# EAGLE design SDuino_ultramicroOLED_Dual (EAGLE 7.1.0)
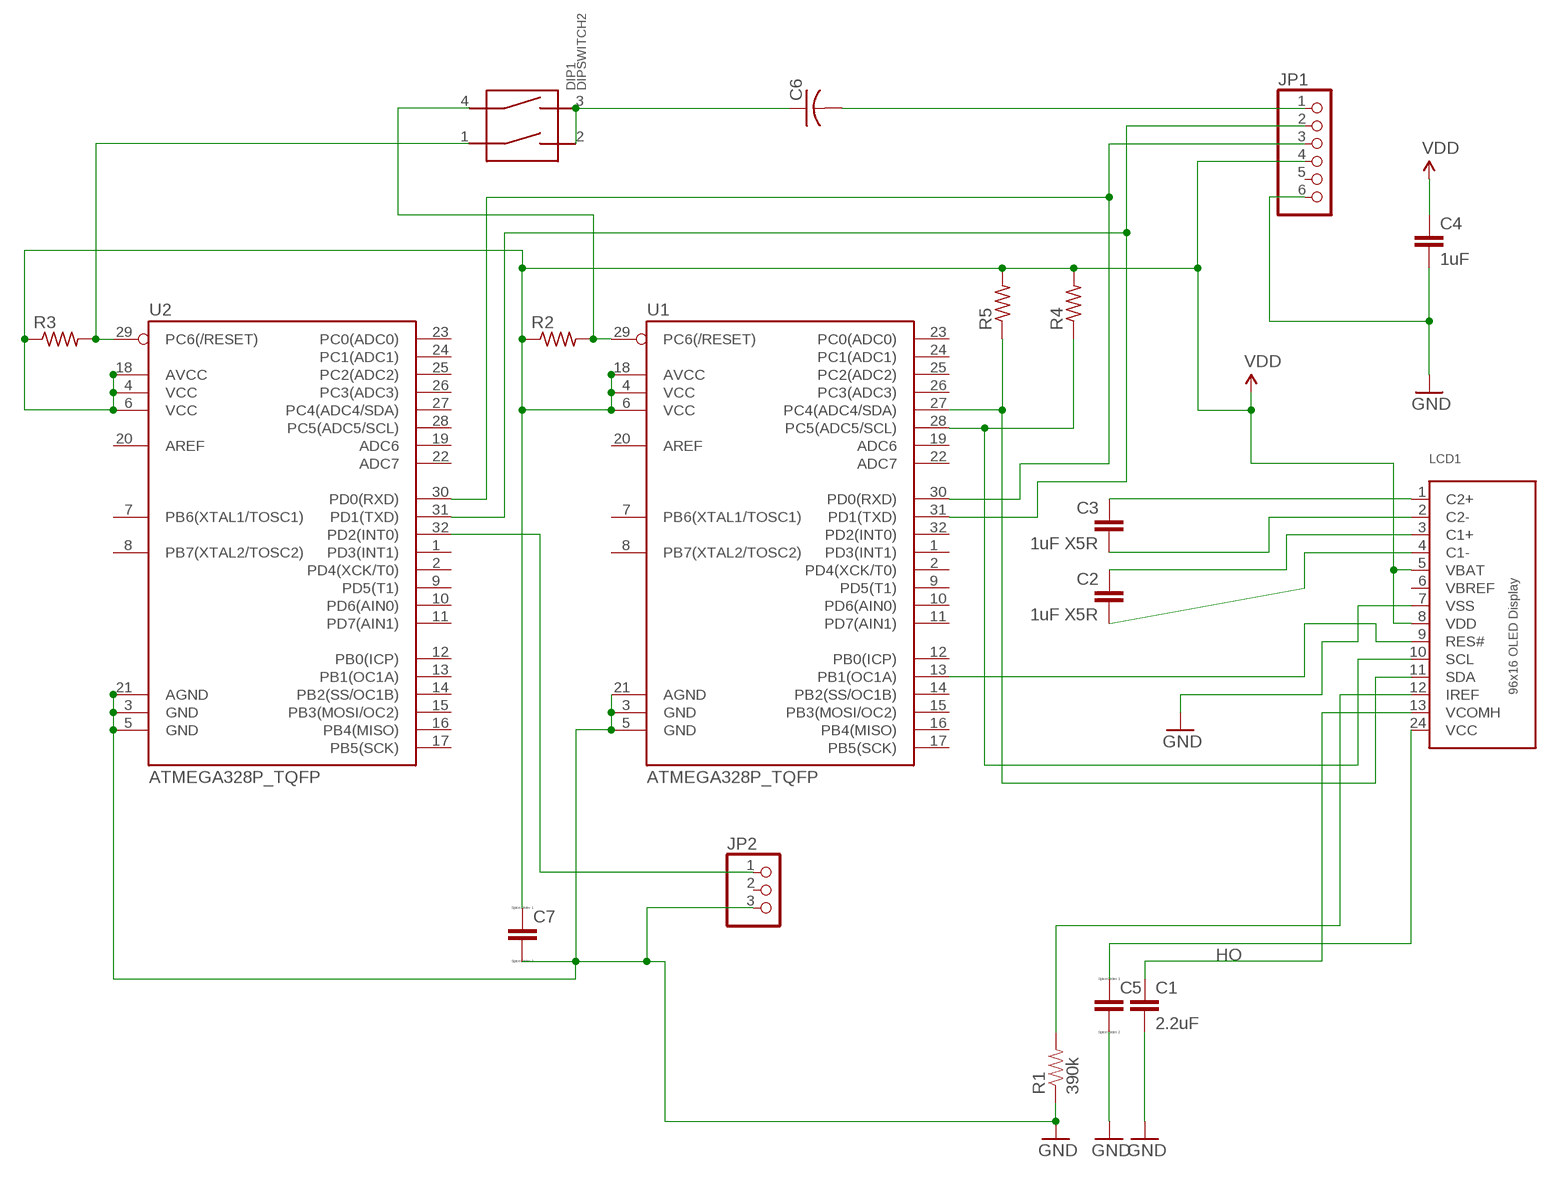
[diagram p0: schematic, sheet 1]

## Parts
C1  2.2uF  CAP0805  [0805]
C2  1uF X5R  CAP0805  [0805]
C3  1uF X5R  CAP0805  [0805]
C4  1uF  CAP0603-CAP  [0603-CAP]
C5  CC0603  [C0603]
C6  C-USC0603K  [C0603K]
C7  CC0603  [C0603]
DIP1  DIPSWITCH2  [DIPSWITCH2]
JP1  HEADER-1X6  [1X06_OVAL]
JP2  HEADER-1X3  [1X03_OVAL]
LCD1  DISP_OLED_UG-9616GLBBG02  [UG-9616GLBBG02_0.65MM_WRAPAROUND]
R1  390k  RESISTOR0603-RES  [0603-RES]
R2  R-US_R0603  [R0603]
R3  R-US_R0603  [R0603]
R4  R-US_R0603  [R0603]
R5  R-US_R0603  [R0603]
U1  ATMEGA328P_TQFP  [TQFP32-08]
U2  ATMEGA328P_TQFP  [TQFP32-08]

## Nets
C1N: C2.2 LCD1.4(C1-)
C1P: C2.1 LCD1.3(C1+)
C2N: C3.2 LCD1.2(C2-)
C2P: C3.1 LCD1.1(C2+)
GND: C1.2 C4.2 C5.2 C7.2 JP1.6 JP2.3 LCD1.7(VSS) R1.1 U1.3(GND) U1.5(GND) U1.21(AGND) U2.3(GND) U2.5(GND) U2.21(AGND)
HO: C1.1 LCD1.13(VCOMH)
IREF: LCD1.12(IREF) R1.2
N$1: LCD1.11(SDA) R5.1 U1.27(PC4(ADC4/SDA))
N$2: DIP1.4 R2.2 U1.29(PC6(/RESET))
N$3: LCD1.9(RES#) U1.13(PB1(OC1A))
N$4: JP2.1 U2.32(PD2(INT0))
N$6: LCD1.10(SCL) R4.1 U1.28(PC5(ADC5/SCL))
N$7: DIP1.1 R3.2 U2.29(PC6(/RESET))
N$9: C6.1 DIP1.2 DIP1.3
N$10: JP1.2 U1.31(PD1(TXD)) U2.31(PD1(TXD))
N$11: JP1.3 U1.30(PD0(RXD)) U2.30(PD0(RXD))
N$14: C6.2 JP1.1
VCOMH: C5.1 LCD1.24(VCC)
VDD: C4.1 C7.1 JP1.4 LCD1.5(VBAT) LCD1.8(VDD) R2.1 R3.1 R4.2 R5.2 U1.4(VCC) U1.6(VCC) U1.18(AVCC) U2.4(VCC) U2.6(VCC) U2.18(AVCC)
Unconnected: JP1.5 JP2.2 LCD1.6(VBREF) U1.1(PD3(INT1)) U1.2(PD4(XCK/T0)) U1.7(PB6(XTAL1/TOSC1)) U1.8(PB7(XTAL2/TOSC2)) U1.9(PD5(T1)) U1.10(PD6(AIN0)) U1.11(PD7(AIN1)) U1.12(PB0(ICP)) U1.14(PB2(SS/OC1B)) U1.15(PB3(MOSI/OC2)) U1.16(PB4(MISO)) U1.17(PB5(SCK)) U1.19(ADC6) U1.20(AREF) U1.22(ADC7) U1.23(PC0(ADC0)) U1.24(PC1(ADC1)) U1.25(PC2(ADC2)) U1.26(PC3(ADC3)) U1.32(PD2(INT0)) U2.1(PD3(INT1)) U2.2(PD4(XCK/T0)) U2.7(PB6(XTAL1/TOSC1)) U2.8(PB7(XTAL2/TOSC2)) U2.9(PD5(T1)) U2.10(PD6(AIN0)) U2.11(PD7(AIN1)) U2.12(PB0(ICP)) U2.13(PB1(OC1A)) U2.14(PB2(SS/OC1B)) U2.15(PB3(MOSI/OC2)) U2.16(PB4(MISO)) U2.17(PB5(SCK)) U2.19(ADC6) U2.20(AREF) U2.22(ADC7) U2.23(PC0(ADC0)) U2.24(PC1(ADC1)) U2.25(PC2(ADC2)) U2.26(PC3(ADC3)) U2.27(PC4(ADC4/SDA)) U2.28(PC5(ADC5/SCL))

## Library data of the parts
C1-C4 = SparkFun-Passives:CAP: Capacitor Standard 0603 ceramic capacitor, and 0.1" leaded capacitor.
C5 C7 = eagle-ltspice:C: CAPACITOR, European symbol; SPICEMODEL: NONE; SPICEPREFIX: C
C6 = rcl:C-US: CAPACITOR, American symbol
DIP1 = carrilib:DIPSWITCH2: 2 Pole Dip Switch, SMD Manufacturer: CTS Part Number: 219-2LPST
JP1 = OLED_mod:HEADER-1X6: PIN HEADER
JP2 = OLED_mod:HEADER-1X3: PIN HEADER
LCD1 = OLED_mod:DISP_OLED_UG-9616GLBBG02: 96x16 0.84" I2C Mono OLED Display
R1 = SparkFun-Passives:RESISTOR: Resistor Basic schematic elements and footprints for 0603, 1206, and PTH resistors.
R2-R5 = resistor:R-US_: RESISTOR, American symbol
U1 U2 = SparkFun-DigitalIC:ATMEGA328P_TQFP; PROD_ID: IC-09069

## Board
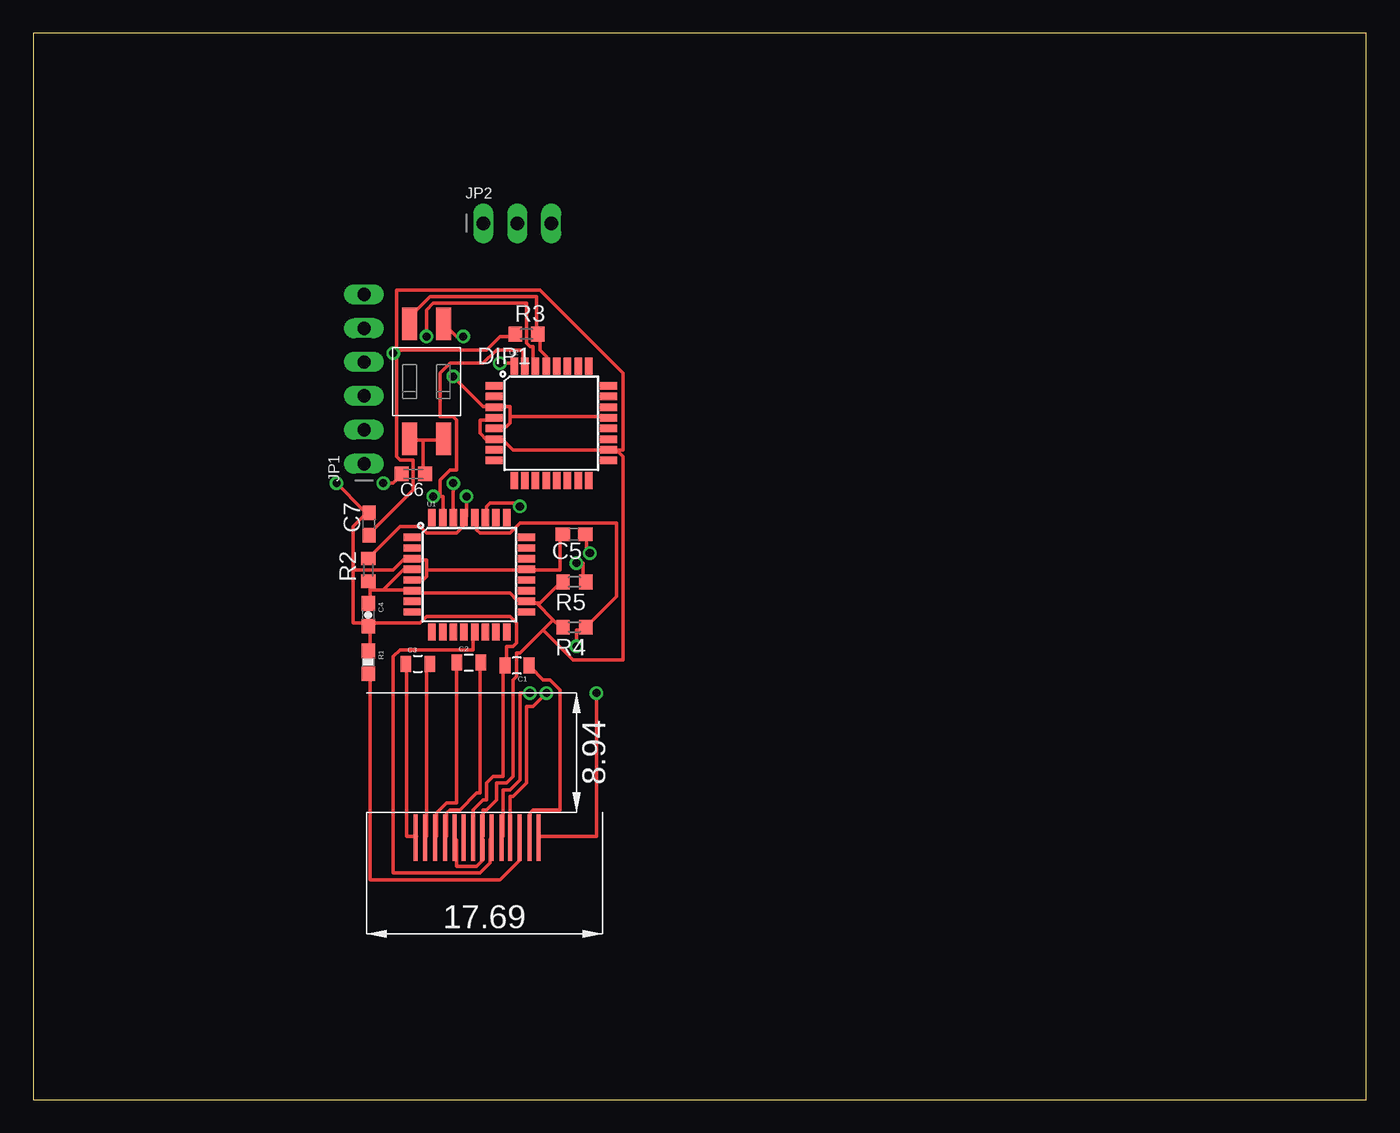
[diagram p1: board, top side]
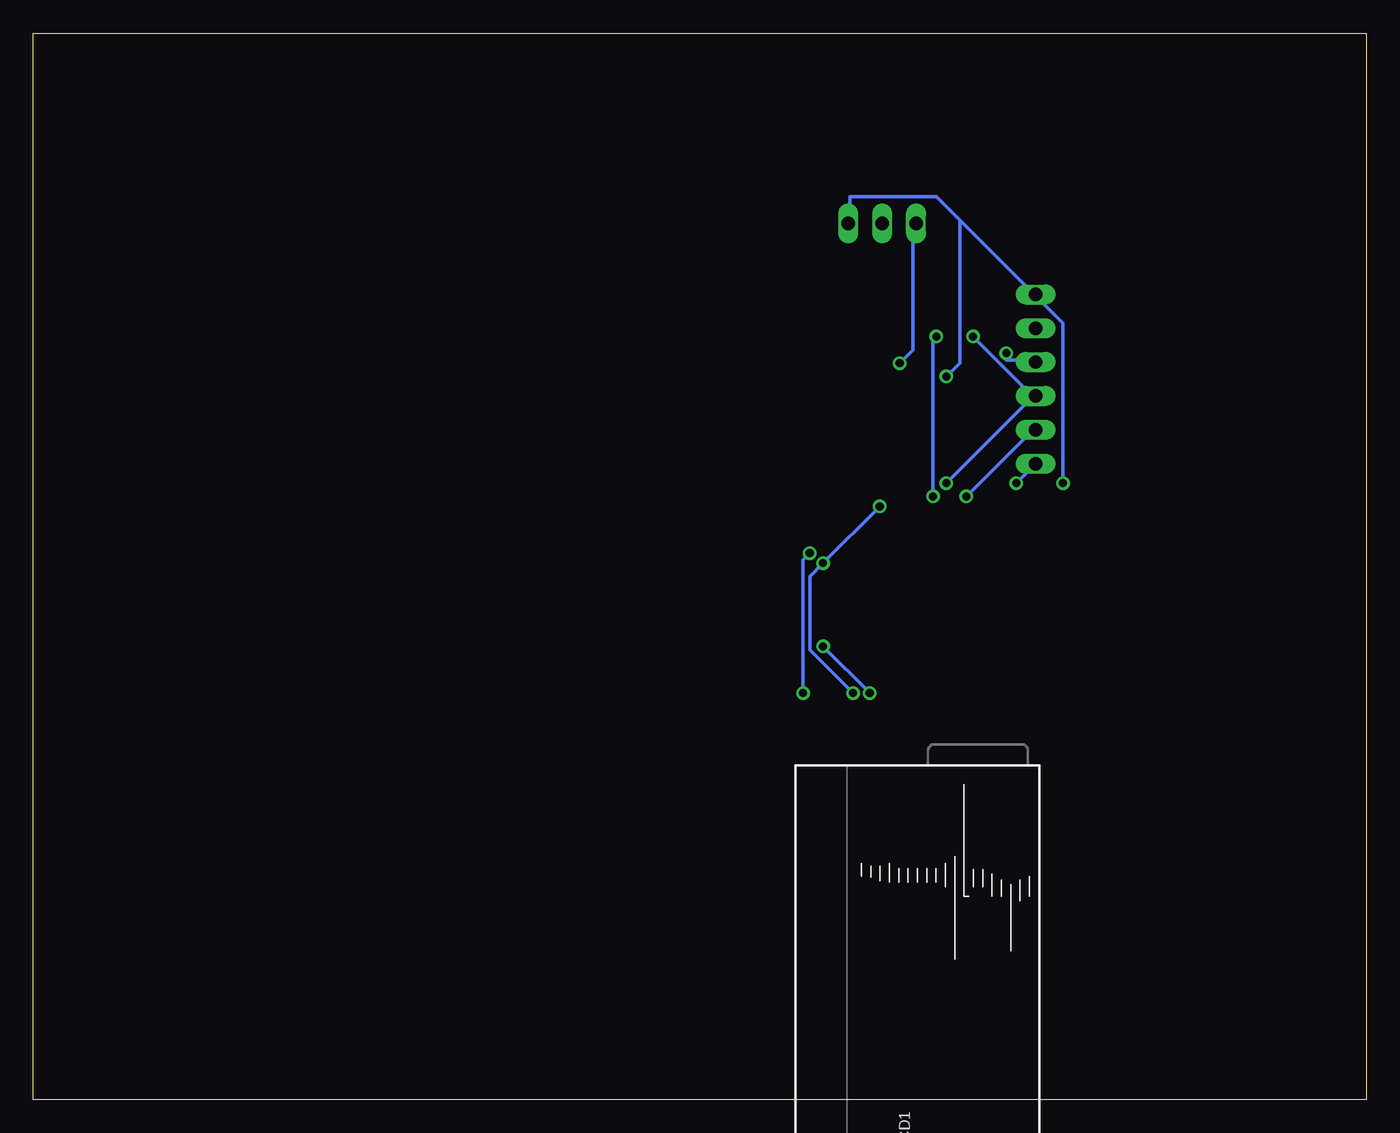
[diagram p2: board, bottom side, seen from below]

Size 100 x 80 mm. Coordinates in mm from the lower left corner, seen from the top.
Outline: 0,0 100,0 100,80 0,80 0,0
Copper layers (1*16): Top 0.035mm / dielectric 1.5mm / Bottom 0.035mm
Design rules "default": minimum track width 10mil, minimum drill 24mil, track to track 8mil, track to pad 8mil, pad to pad 8mil, via to via 8mil, smd to smd 8mil, copper to edge 40mil, drill to drill 8mil, minimum pad ring 10mil, minimum via ring 8mil, stop-mask expansion 4mil, vias tented up to drill 0mil, thermal gap 10mil
tRestrict: area 32.9,64.2 to 34.6,67.2; area 35.6,64.1 to 37.1,67.2; area 38.1,64.2 to 39.6,67.2; area 23.1,59.6 to 26.4,61.2; area 23.1,57.1 to 26.4,58.6; area 23.1,54.6 to 26.4,55.9; area 23.2,52 to 26.3,53.6; area 23.1,49.3 to 26.4,51; area 23.1,46.8 to 26.4,48.4
vRestrict: area 29.4,36.2 to 36.1,42.9; area 35.5,47.6 to 42.2,54.2; area 3.7,3.2 to 63.1,29.8

### Footprints (pad centres in the part's own frame; a part is rotated, then mirrored left to right if it is on the bottom)
0805 = smd 0.8 x 1.2: 1 -0.9,0; 2 0.9,0
0603-CAP = smd 1.1 x 1: 1 -0.85,0; 2 0.85,0
C0603 = smd 1.1 x 1: 1 -0.85,0; 2 0.85,0
C0603K = smd 1.05 x 1.08: 1 -0.875,0; 2 0.875,0
DIPSWITCH2 = smd 1.118 x 2.438: 1 -1.27,4.318; 2 -1.27,-4.318; 3 1.27,-4.318; 4 1.27,4.318
1X06_OVAL = drill 1 long: 1 -6.35,0; 2 -3.81,0; 3 -1.27,0; 4 1.27,0; 5 3.81,0; 6 6.35,0
1X03_OVAL = drill 1 long: 1 -2.54,0; 2 0,0; 3 2.54,0
UG-9616GLBBG02_0.65MM_WRAPAROUND = smd 3.5 x 0.3 bottom: 1 -5.4,-0.463; 2 -5.4,0.275; 3 -5.4,1.012; 4 -5.4,1.75; 5 -5.4,2.487; 6 -5.4,3.138; 7 -5.4,3.875; 8 -5.4,4.525; 9 -5.4,5.263; 10 -5.4,6; 11 -5.4,6.65; 12 -5.4,7.338; 13 -5.4,8.088; 24 -5.4,8.775
0603-RES = smd 1.1 x 1: 1 -0.85,0; 2 0.85,0
R0603 = smd 1 x 1.1: 1 -0.85,0; 2 0.85,0
TQFP32-08 = smd 1.27 x 0.559: 1 -4.293,2.8; 2 -4.293,2; 3 -4.293,1.2; 4 -4.293,0.4; 5 -4.293,-0.4; 6 -4.293,-1.2; 7 -4.293,-2; 8 -4.293,-2.8; 17 4.293,-2.8; 18 4.293,-2; 19 4.293,-1.2; 20 4.293,-0.4; 21 4.293,0.4; 22 4.293,1.2; 23 4.293,2; 24 4.293,2.8 | smd 0.559 x 1.27: 9 -2.8,-4.293; 10 -2,-4.293; 11 -1.2,-4.293; 12 -0.4,-4.293; 13 0.4,-4.293; 14 1.2,-4.293; 15 2,-4.293; 16 2.8,-4.293; 25 2.8,4.293; 26 2,4.293; 27 1.2,4.293; 28 0.4,4.293; 29 -0.4,4.293; 30 -1.2,4.293; 31 -2,4.293; 32 -2.8,4.293

### Placement (x,y rotation side)
C1  36.29,32.56 180 top
C2  32.67,32.78 0 top
C3  28.84,32.69 0 top
C4  25.13,36.38 270 top
C5  40.56,42.41 180 top
C6  28.5,46.94 180 top
C7  25.19,43.19 90 top
DIP1  29.5,53.88 0 top
JP1  24.81,54.06 90 top
JP2  36.31,65.75 0 top
LCD1  29.12,25.06 90 bottom
R1  25.13,32.81 270 top
R2  25.13,39.75 90 top
R3  37,57.44 0 top
R4  40.59,35.45 180 top
R5  40.59,38.83 180 top
U1  32.71,39.38 0 top
U2  38.88,50.75 0 top

### Tracks (layer width: path | path; a pad name or v marks a point on that pad's centre or on a via)
C1N
  Top 0.254: C2.2 33.5,32.75 33.5,23 33.25,23 32,21.75 31.25,21.75 31,21.5 31,19.75 LCD1.4
C1P
  Top 0.254: C2.1 31.75,32.75 31.75,22.25 31,22.25 30.25,21.5 30.25,19.75 LCD1.3
C2N
  Top 0.254: C3.2 29.5,32.5 29.5,19.75 LCD1.2
C2P
  Top 0.254: C3.1 28,32.5 28,19.75 28.75,19.75 LCD1.1
GND  (via drill 0.61)
  Top 0.254: 35.75,51.25 35.75,52 34.75,52 U2.3 34.5,52 33.75,52 v31.5,54.25 | 35.75,51.25 35.75,50.75 35.5,50.5 34.75,50.5 U2.5 | 35.75,51.25 43,51.25 U2.21 | LCD1.7 33,21.75 33.75,22.5 34,22.5 34,23.75 34.5,24.25 35.25,24.25 35.25,32.5 C1.2 35.5,32.75 35.5,34 36,34 36.25,34.25 36.25,35.75 35.75,36.25 29.5,36.25 29,35.75 25.25,35.75 C4.2 | C4.2 25.25,35.5 25.25,33.75 R1.1 | 24,39.75 24,35.75 25,35.75 C4.2 | 24,39.75 24,43 25,44 C7.2 25,44.25 24.75,44.25 v22.75,46.25 | 29.5,39.75 29.5,40.5 28.5,40.5 U1.3 28.25,40.5 27.75,40.5 27,39.75 24,39.75 | 29.5,39.75 29.5,39.25 29.25,39 28.5,39 U1.5 | C5.2 39.5,42.25 39.5,39.75 37.25,39.75 U1.21 37,39.75 29.5,39.75
  Bottom 0.254: 30.5,66 32.25,67.75 38.75,67.75 38.75,65.75 JP2.3 | 30.5,66 25,60.5 JP1.6 24.75,60.25 22.75,58.25 v22.75,46.25 | v31.5,54.25 30.5,55.25 30.5,66
HO
  Top 0.254: C1.1 37.25,32.5 38.25,31.5 38.75,31.5 39.5,30.75 39.5,21.75 37.5,21.75 37.25,21.5 37.25,19.75 LCD1.13
IREF
  Top 0.254: R1.2 25.25,31.75 25.25,16.5 35,16.5 36.5,18 36.5,19.5 LCD1.12
N$1  (via drill 0.61)
  Top 0.254: v40.75,40.25 41.25,40.25 41.25,39 R5.1 | v36.5,44.5 36.25,44.75 34.25,44.75 34,44.5 34,43.75 U1.27 | v38.5,30.5 37.5,29.5 37,29.5 37,23.75 36,22.75 35.75,22.75 35.75,19.75 LCD1.11
  Bottom 0.254: v36.5,44.5 v40.75,40.25 41.75,39.25 41.75,33.75 v38.5,30.5
N$2  (via drill 0.61)
  Top 0.254: R2.2 25.25,40.75 27.5,43 29,43 29.5,42.5 31.75,42.5 32.25,43 32.25,43.5 U1.29 32.5,43.75 v32.5,45.25 | v32.25,57.25 31.75,57.25 31,58 DIP1.4
  Bottom 0.254: v32.25,57.25 32.5,57 v32.5,45.25
N$3
  Top 0.254: U1.13 33,35 33,33.75 27.5,33.75 27,33.25 27,17 33.5,17 34.25,17.75 34.25,19.5 LCD1.9
N$4  (via drill 0.61)
  Top 0.254: v35,55.25 36,55.25 U2.32
  Bottom 0.254: v35,55.25 34,56.25 34,65.75 JP2.1
N$6  (via drill 0.61)
  Top 0.254: U1.28 33.25,43.5 33.25,42.75 33.5,42.5 35.75,42.5 36.5,43.25 43.75,43.25 43.75,37.75 41.5,35.5 R4.1 41.25,35.25 40.75,35.25 v40.75,34 | v37.25,30.5 36.5,30.5 36.5,24 35.75,23.25 35.25,23.25 35.25,19.75 LCD1.10
  Bottom 0.254: v40.75,34 v37.25,30.5
N$7
  Top 0.254: U2.29 38.5,55.25 38.5,55.75 38,56.25 38,57.25 R3.2 37.75,57.5 37.75,60.25 29.75,60.25 28.25,58.75 28.25,58.25 DIP1.1
N$9
  Top 0.254: 29.25,49.5 29.25,47 C6.1 | 29.25,49.5 28.25,49.5 DIP1.2 | 29.25,49.5 30.75,49.5 DIP1.3
N$10  (via drill 0.61)
  Top 0.254: 30.5,45.25 30.75,45.25 30.75,43.75 U1.31 | 30.5,45.25 30.5,46.5 31.25,47.25 31.75,47.25 31.75,51 31.5,51.25 30.5,51.25 30.5,54.5 31.25,55.25 33.75,55.25 34.75,56.25 36.75,56.25 36.75,55.25 U2.31 | 30.5,45.25 v30,45.25
  Bottom 0.254: v30,45.25 25,50.25 JP1.2
N$11  (via drill 0.61)
  Top 0.254: v31.5,46.25 31.5,43.75 U1.30 | v29.5,57.25 29.5,59.25 30,59.75 37,59.75 37,56.75 37.25,56.5 37.5,56.5 37.5,55.25 U2.30
  Bottom 0.254: 25,52.75 v31.5,46.25 | 25,52.75 v29.5,57.25 | 25,52.75 JP1.3
N$14  (via drill 0.61)
  Top 0.254: v26.25,46.25 27,46.25 27.5,46.75 C6.2
  Bottom 0.254: v26.25,46.25 25,47.5 JP1.1
VCOMH  (via drill 0.61)
  Top 0.254: v41.75,41 41.5,41 41.5,42.25 C5.1 | v42.25,30.5 42.25,19.75 38,19.75 LCD1.24
  Bottom 0.254: v41.75,41 42.25,40.5 v42.25,30.5
VDD  (via drill 0.61)
  Top 0.254: 27.25,56.25 27.25,56 | 27.25,56 27.25,48.25 27.5,48 28.5,48 28.5,45.75 25.25,42.5 C7.1 | 27.25,56.25 34,56.25 35,57.25 36,57.25 R3.1 | 27.25,56 v27,56 27.25,56.25 | U2.4 34.5,51 33.5,51 33.5,50 34,49.5 34.5,49.5 U2.6 34.75,49.5 35.25,49.5 36,48.75 U2.18 | LCD1.5 31.75,19.5 31.75,17.5 33.25,17.5 33.75,18 33.75,19.5 LCD1.8 33.75,19.75 33.75,21.75 34,21.75 34.75,22.5 34.75,23.75 35.5,23.75 36,24.25 36,31.5 36.25,31.75 36.25,33.5 36.5,33.5 38.25,35.25 | 25.25,38.25 25.25,38.75 R2.1 | 25.25,38.25 25.25,37.25 C4.1 | 25.25,38.25 26.25,38.25 | 26.25,38.25 28.25,38.25 U1.6 28.5,38 35.75,38 36.25,37.5 37,37.5 U1.18 37.25,37.25 37.75,37.25 | 26.25,38.25 27.75,39.75 28.25,39.75 U1.4 | 37.75,37.25 39,36 | 39,36 39.5,35.5 R4.2 | 37.75,37.25 38,37.25 39.5,38.75 R5.2 | 39,36 38.25,35.25 | 43.75,48.75 U2.18 | 43.75,48.75 44.25,48.25 44.25,33 40.5,33 38.25,35.25 | 27.25,56.25 27.25,60.75 38,60.75 44.25,54.5 44.25,48.75 43.75,48.75 | 43.25,48.75 U2.18
  Bottom 0.254: v27,56 27,55.5 25,55.5 JP1.4